# Altium schematic sheet A2D.schdoc
size 465 x 382 mm
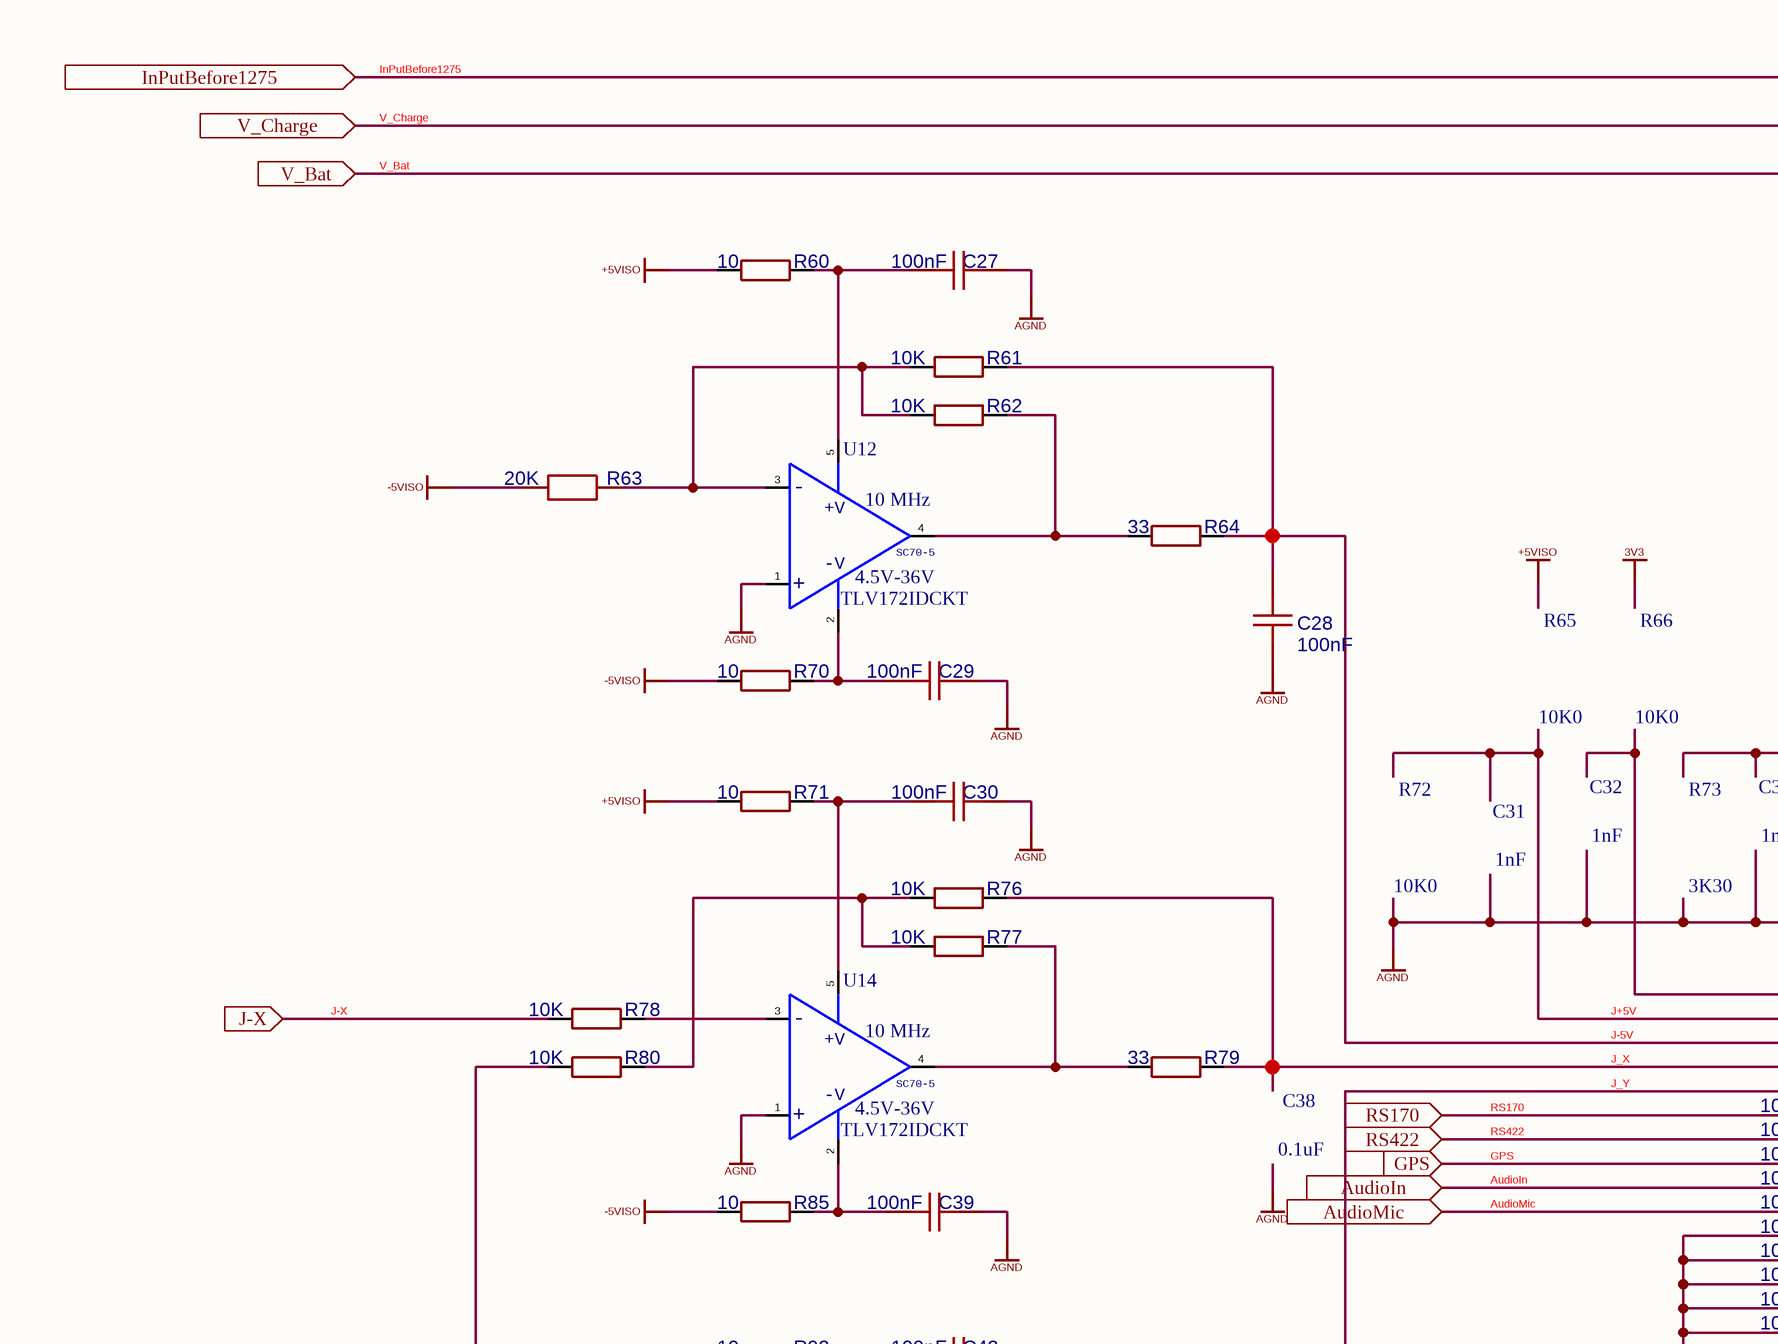
[diagram p0: A2D.schdoc, top left]
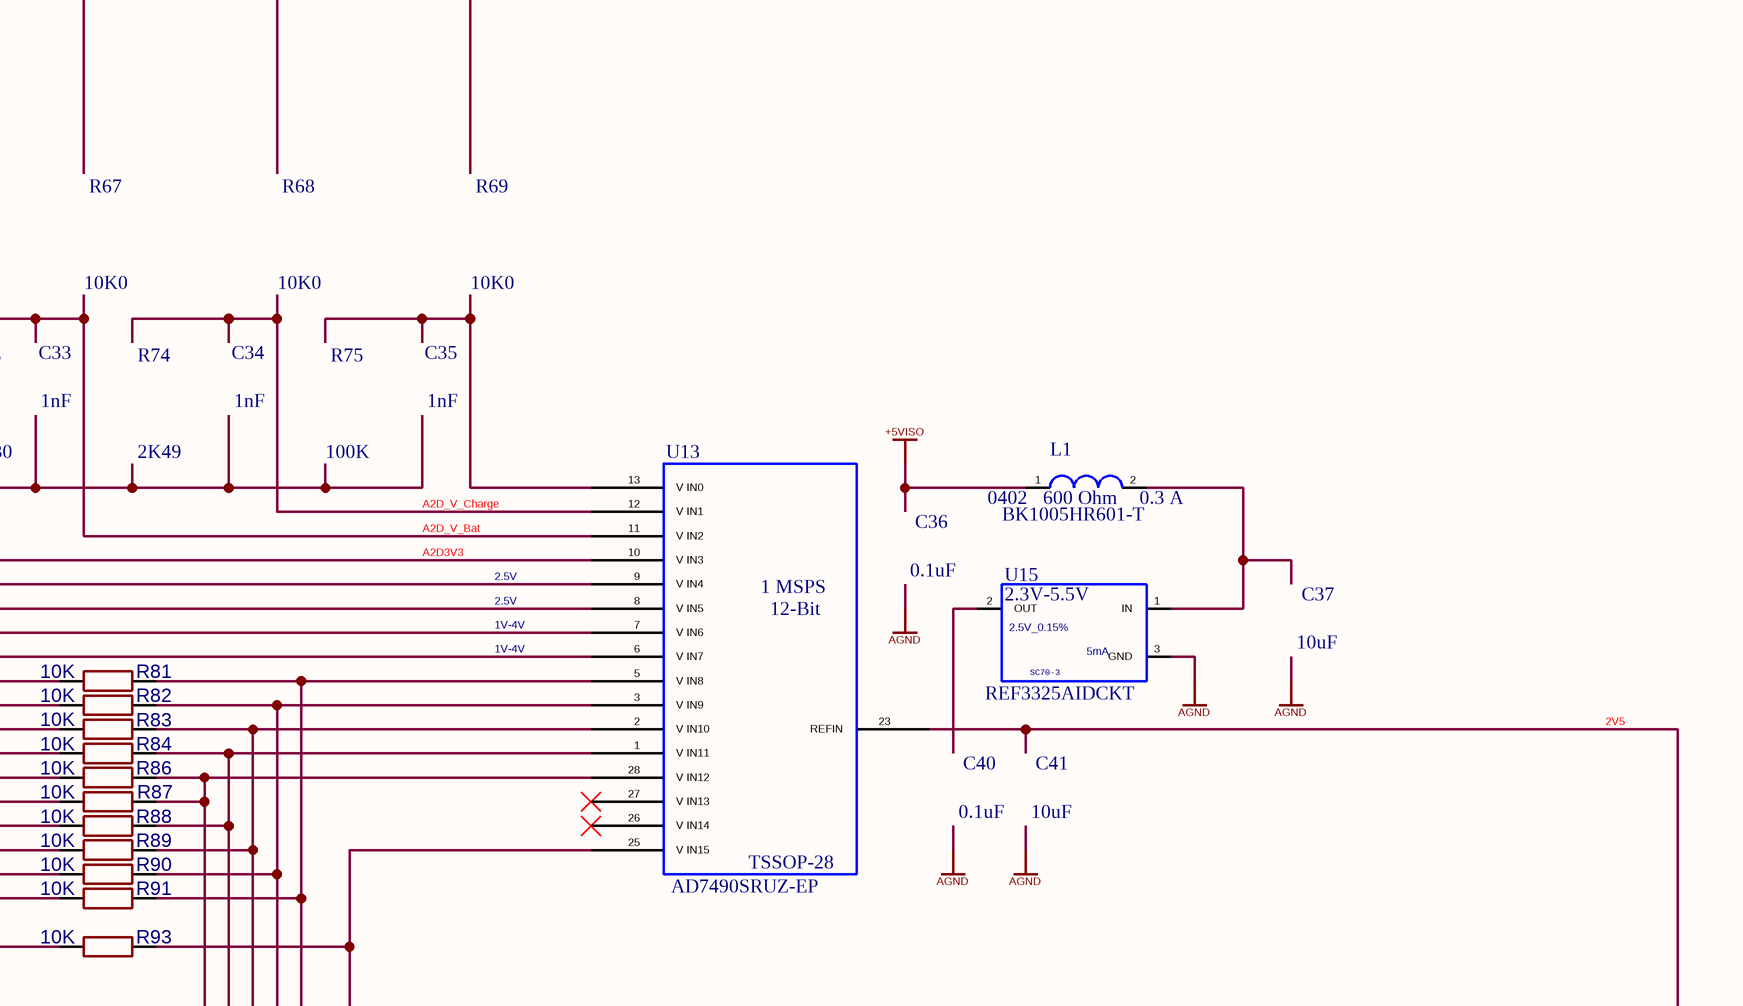
[diagram p1: A2D.schdoc, top right]
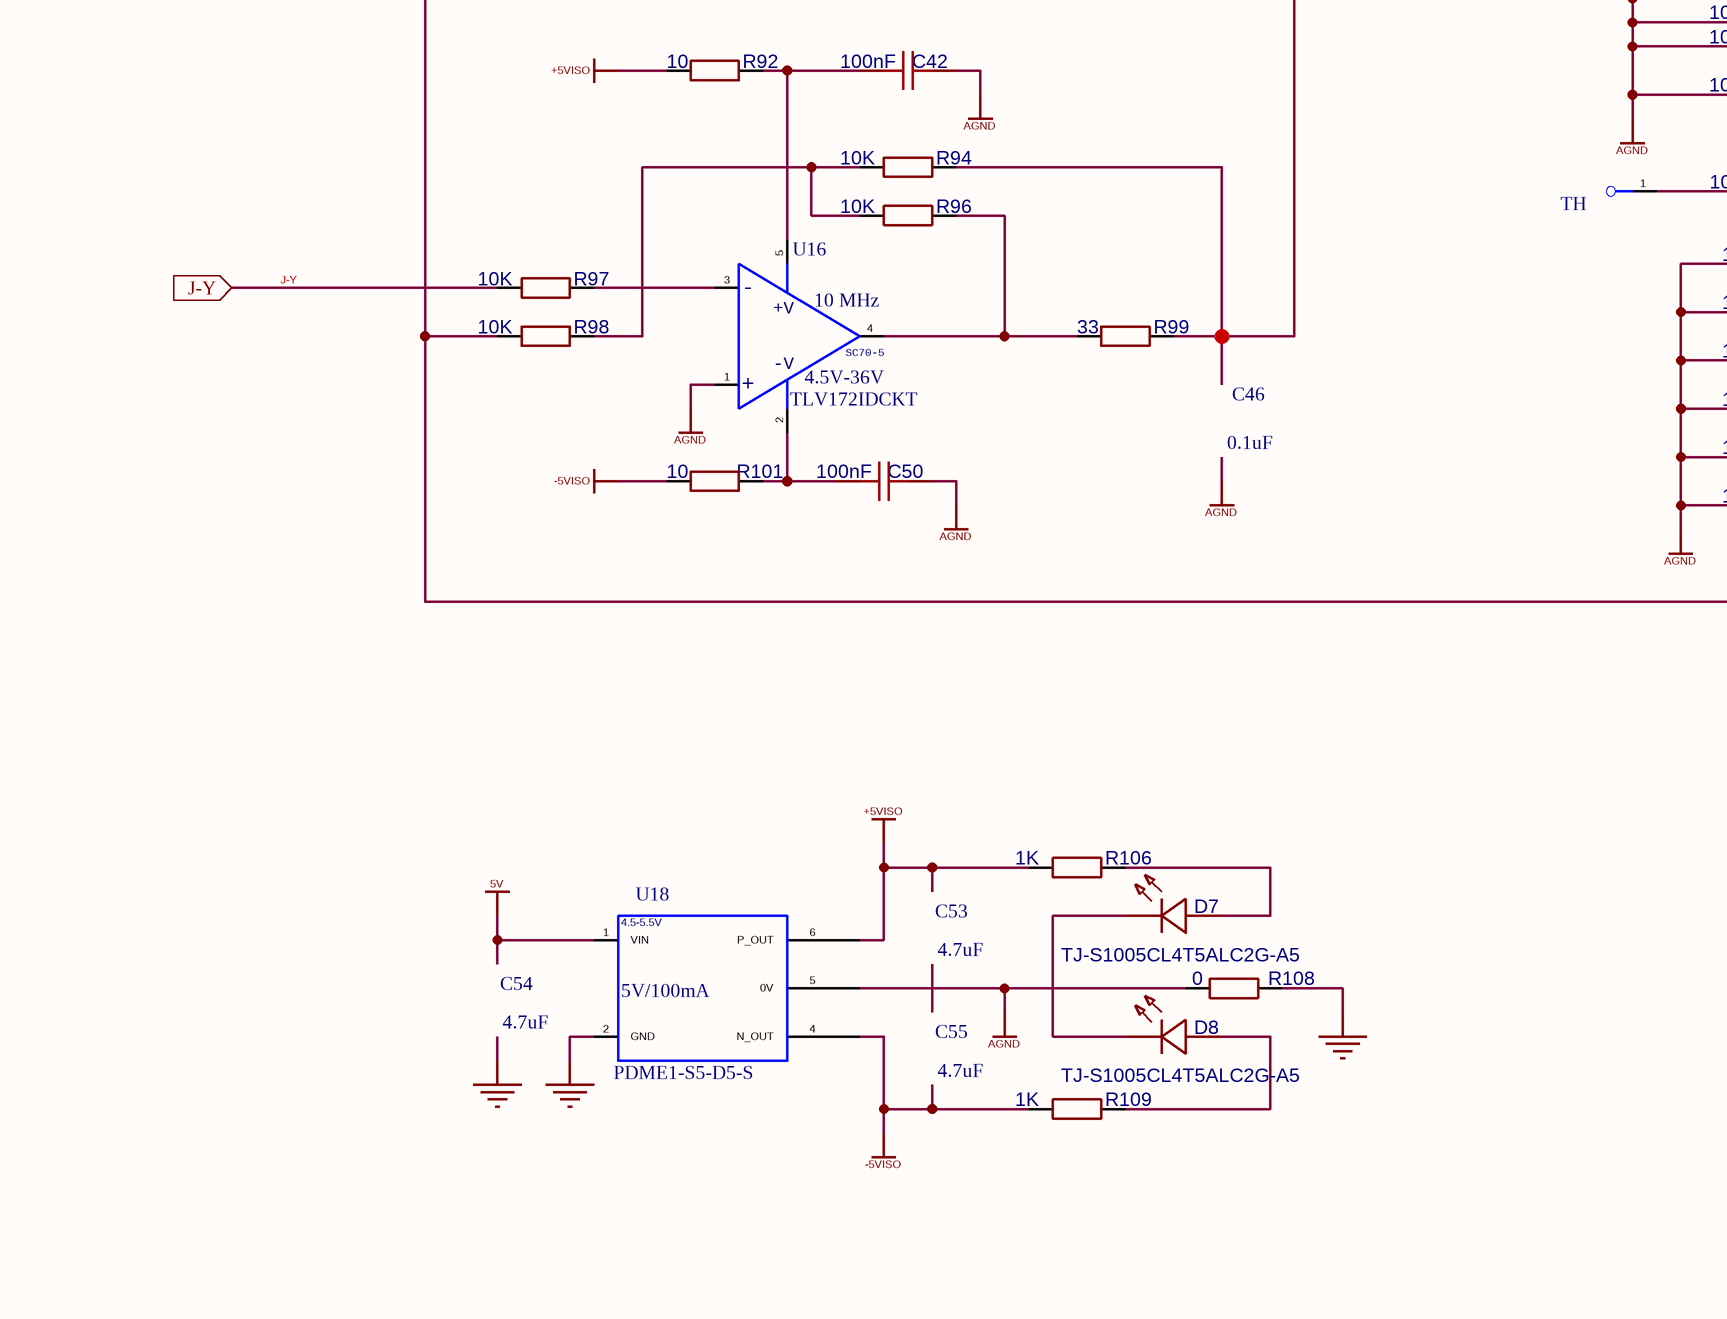
[diagram p2: A2D.schdoc, bottom left]
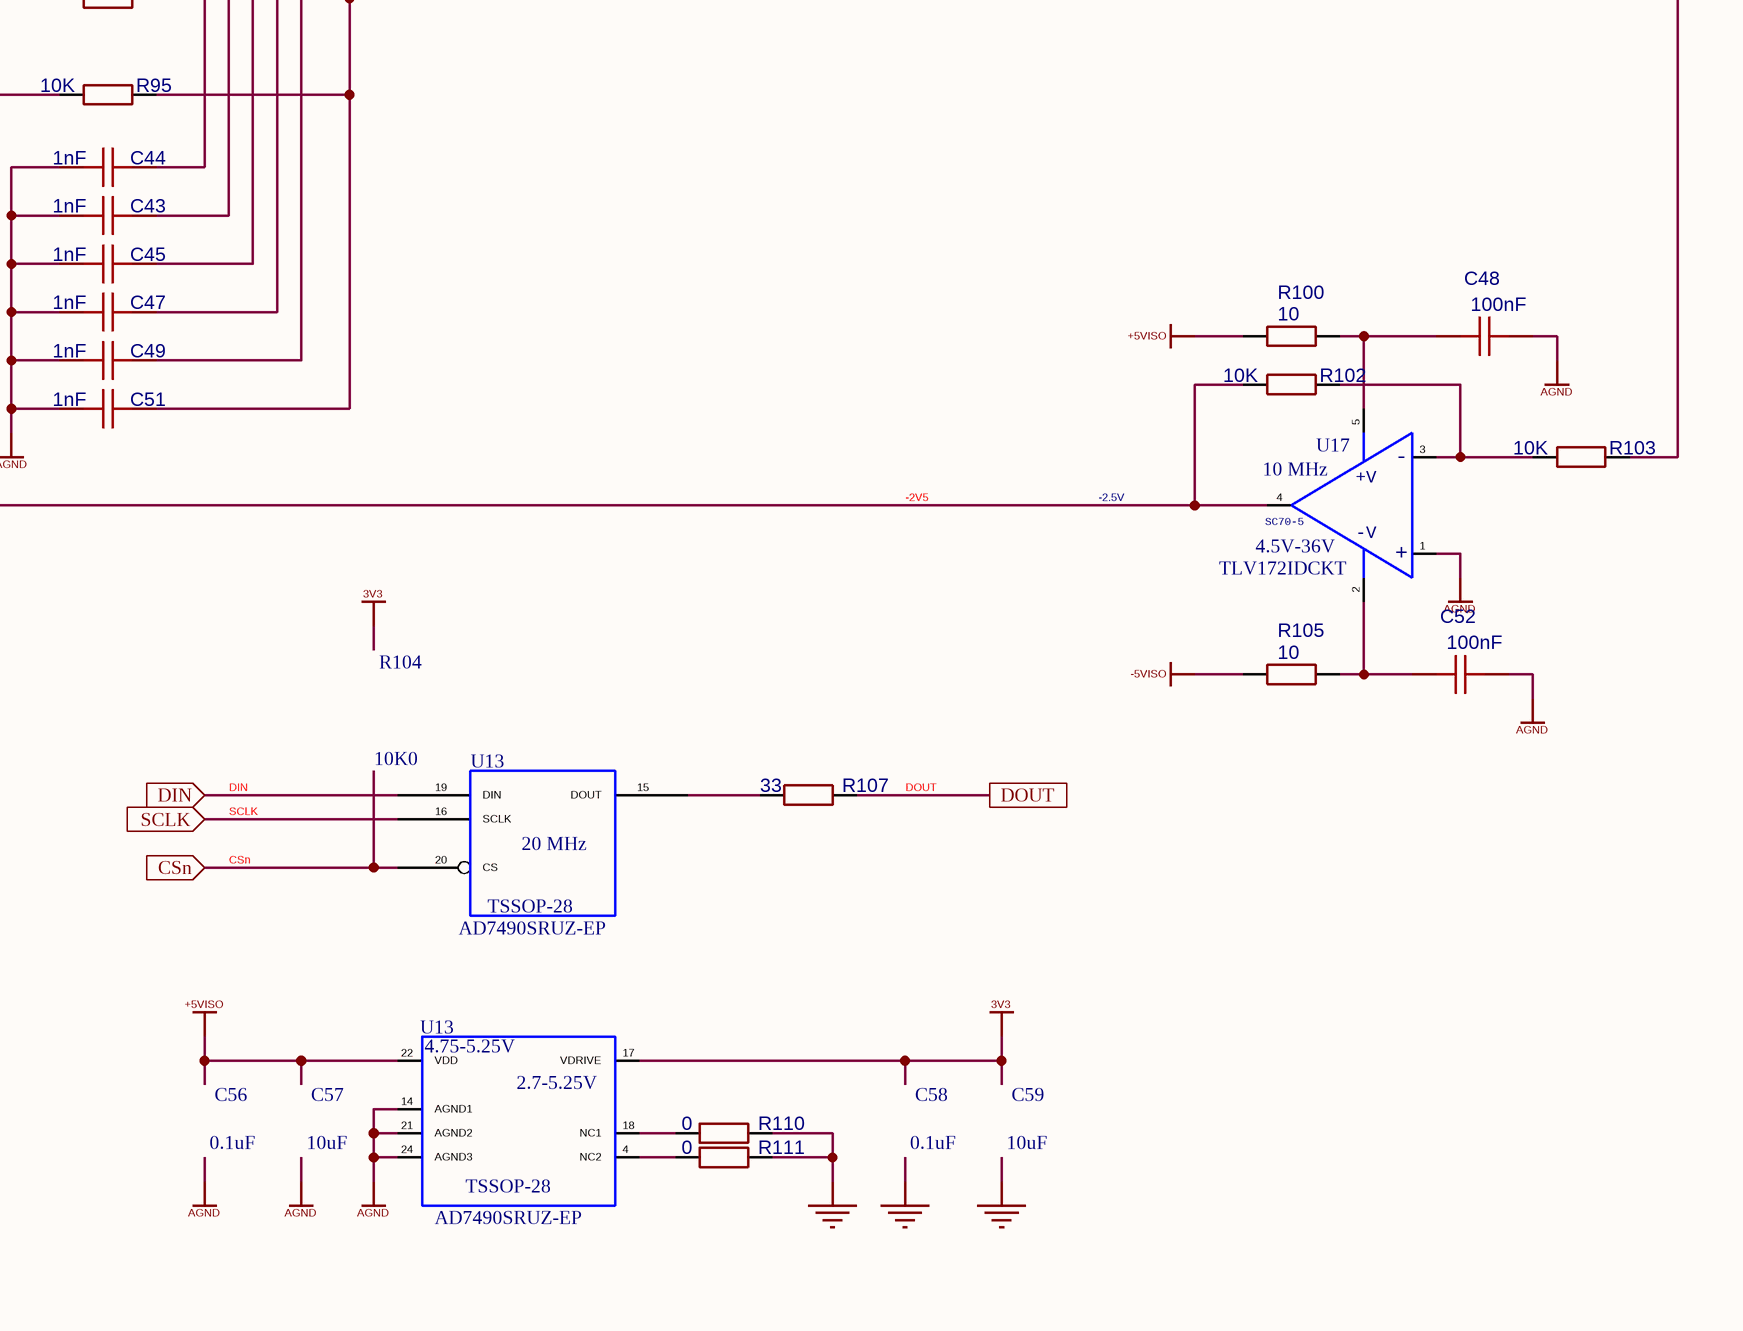
[diagram p3: A2D.schdoc, bottom right]

## Parts
(Parts that share a designator on the sheet are numbered #1, #2 ... from top to bottom, then left to right.)
C27  100nF  [C0402]
C28  100nF  [C0402]
C29  100nF  [C0402]
C30  100nF  [C0402]
C31  1nF  [0402]
C32  1nF  [0402]
C33  1nF  [0402]
C34  1nF  [0402]
C35  1nF  [0402]
C36  0.1uF  [0402]
C37  10uF  [0402]
C38  0.1uF  [0402]
C39  100nF  [C0402]
C40  0.1uF  [0402]
C41  10uF  [0402]
C42  100nF  [C0402]
C43  1nF  [C0402]
C44  1nF  [C0402]
C45  1nF  [C0402]
C46  0.1uF  [0402]
C47  1nF  [C0402]
C48  100nF  [C0402]
C49  1nF  [C0402]
C50  100nF  [C0402]
C51  1nF  [C0402]
C52  100nF  [C0402]
C53  4.7uF  [0603]
C54  4.7uF  [0603]
C55  4.7uF  [0603]
C56  0.1uF  [0402]
C57  10uF  [0402]
C58  0.1uF  [0402]
C59  10uF  [0402]
D7  TJ-S1005CL4T5ALC2G-A5  [LED0402-RD]
D8  TJ-S1005CL4T5ALC2G-A5  [LED0402-RD]
ICT1  TH  [CASCODIUM_TP_ICT]
L1  BK1005HR601-T  [L0402]
R60  10  [R0402]
R61  10K  [R0402]
R62  10K  [R0402]
R63  20K  [R0402]
R64  33  [R0402]
R65  10K0  [0402]
R66  10K0  [0402]
R67  10K0  [0402]
R68  10K0  [0402]
R69  10K0  [0402]
R70  10  [R0402]
R71  10  [R0402]
R72  10K0  [0402]
R73  3K30  [0402]
R74  2K49  [0402]
R75  100K  [0402]
R76  10K  [R0402]
R77  10K  [R0402]
R78  10K  [R0402]
R79  33  [R0402]
R80  10K  [R0402]
R81  10K  [R0402]
R82  10K  [R0402]
R83  10K  [R0402]
R84  10K  [R0402]
R85  10  [R0402]
R86  10K  [R0402]
R87  10K  [R0402]
R88  10K  [R0402]
R89  10K  [R0402]
R90  10K  [R0402]
R91  10K  [R0402]
R92  10  [R0402]
R93  10K  [R0402]
R94  10K  [R0402]
R95  10K  [R0402]
R96  10K  [R0402]
R97  10K  [R0402]
R98  10K  [R0402]
R99  33  [R0402]
R100  10  [R0402]
R101  10  [R0402]
R102  10K  [R0402]
R103  10K  [R0402]
R104  10K0  [0402]
R105  10  [R0402]
R106  1K  [R0402]
R107  33  [R0402]
R108  0  [R0402]
R109  1K  [R0402]
R110  0  [R0402]
R111  0  [R0402]
U12  TLV172IDCKT  [SC70-5]
U13#1  AD7490SRUZ-EP  [TSSOP-28_AD7490SRUZ]
U13#2  AD7490SRUZ-EP  [TSSOP-28_AD7490SRUZ]
U13#3  AD7490SRUZ-EP  [TSSOP-28_AD7490SRUZ]
U14  TLV172IDCKT  [SC70-5]
U15  REF3325AIDCKT  [SC70-3_REF3320AIDCKR]
U16  TLV172IDCKT  [SC70-5]
U17  TLV172IDCKT  [SC70-5]
U18  PDME1-S5-D5-S  [PDME1-S5-D5-S]

## Ports
AudioIn (in), AudioMic (in), CSn (in), DIN (in), DOUT (in), GPS (in), InPutBefore1275 (in), J-X (in), J-Y (in), RS170 (in), RS422 (in), SCLK (in), V_Bat (in), V_Charge (in)

## Nets
3V3: U13#3.17(VDRIVE)
5V: U18.1(VIN)
+5VISO: L1.1 R60.1 R71.1 R92.1 R100.1 R106.1 U13#3.22(VDD) U18.6(P_OUT)
-5VISO: R63.1 R70.1 R85.1 R101.1 R105.1 R109.1 U18.4(N_OUT)
AGND: C27.1 C28.2 C29.1 C30.1 C39.1 C42.1 C43.1 C44.1 C45.1 C47.1 C48.1 C49.1 C50.1 C51.1 C52.1 R87.1 R88.1 R89.1 R90.1 R91.1 R93.1 R108.1 U12.1(+In) U13#3.14(AGND1) U13#3.21(AGND2) U13#3.24(AGND3) U14.1(+In) U15.3(GND) U16.1(+In) U17.1(+In) U18.5(0V)
GND: R108.2 R110.2 R111.2 U18.2(GND)
2V5: R103.2 U13#1.23(REFIN) U15.2(OUT)
-2V5: R80.1 R98.1 R102.1 U17.4(OutPut)
A2D3V3: U13#1.10(V_IN3)
A2D_V_Bat: U13#1.11(V_IN2)
A2D_V_Charge: U13#1.12(V_IN1)
AudioIn: R84.1 ; port AudioIn
AudioMic: R86.1 ; port AudioMic
CSn: U13#2.20(CS) ; port CSn
DIN: U13#2.19(DIN) ; port DIN
DOUT: R107.2 ; port DOUT
GPS: R83.1 ; port GPS
InPutBefore1275: port InPutBefore1275
J+5V: U13#1.9(V_IN4)
J-5V: C28.1 R61.2 R64.2 U13#1.8(V_IN5)
J-X: R78.1 ; port J-X
J-Y: R97.1 ; port J-Y
J_X: R76.2 R79.2 U13#1.7(V_IN6)
J_Y: R81.1 R82.1 R94.2 R99.2 U13#1.6(V_IN7) ; port RS170, port RS422  [also labelled RS170, RS422]
SCLK: U13#2.16(SCLK) ; port SCLK
V_Bat: port V_Bat
V_Charge: port V_Charge
NetC27_2: C27.2 R60.2 U12.5(+V)
NetC29_2: C29.2 R70.2 U12.2(-V)
NetC30_2: C30.2 R71.2 U14.5(+V)
NetC39_2: C39.2 R85.2 U14.2(-V)
NetC42_2: C42.2 R92.2 U16.5(+V)
NetC43_2: C43.2 R84.2 R88.2 U13#1.1(V_IN11)
NetC44_2: C44.2 R86.2 R87.2 U13#1.28(V_IN12)
NetC45_2: C45.2 R83.2 R89.2 U13#1.2(V_IN10)
NetC47_2: C47.2 R82.2 R90.2 U13#1.3(V_IN9)
NetC48_2: C48.2 R100.2 U17.5(+V)
NetC49_2: C49.2 R81.2 R91.2 U13#1.5(V_IN8)
NetC50_2: C50.2 R101.2 U16.2(-V)
NetC51_2: C51.2 R93.2 R95.2 U13#1.25(V_IN15)
NetC52_2: C52.2 R105.2 U17.2(-V)
NetD7_1: D7.1(K) D8.1(K)
NetD7_2: D7.2(A) R106.2
NetD8_2: D8.2(A) R109.2
NetICT1_1: ICT1.1 R95.1
NetL1_2: L1.2 U15.1(IN)
NetR61_1: R61.1 R62.1 R63.2 U12.3(-In)
NetR62_2: R62.2 R64.1 U12.4(OutPut)
NetR76_1: R76.1 R77.1 R80.2
NetR77_2: R77.2 R79.1 U14.4(OutPut)
NetR78_2: R78.2 U14.3(-In)
NetR94_1: R94.1 R96.1 R98.2
NetR96_2: R96.2 R99.1 U16.4(OutPut)
NetR97_2: R97.2 U16.3(-In)
NetR102_2: R102.2 R103.1 U17.3(-In)
NetR107_1: R107.1 U13#2.15(DOUT)
NetR110_1: R110.1 U13#3.18(NC1)
NetR111_1: R111.1 U13#3.4(NC2)

Not connected (* = marked no-connect by the designer): U13#1 13(V_IN0) 26(V_IN14)* 27(V_IN13)*

## Notes on the sheet
- 1V-4V
- 2.5V
- -2.5V
- (in symbol REF3325AIDCKT) SC70-3
- (in symbol TLV172IDCKT) -; SC70-5; +

## Library data of the parts
C27-C30 C39 C42 C48 C50 C52 = 100nF: BOM_Manufacturer: TDK; BOM_Manufacturer Part: C1005X7R1C104KT000F; nameAlias: Capacitance; Contributor: LCSC; BOM_Supplier: LCSC; BOM_Supplier Part: C338032; spicePre: C; spiceSymbolName: C1005X7R1C104KT000F
C31-C35 = 1nF: Part Number: C0402C102J5JAC7867; VOLTAGE: 50V; TYPE: U2J; PCBFootPrint: 0402   U2J; OVPN: OVCC00016; NO_XNET_CONNECTION: True; MFG: KEMET; ALT_SYMBOLS: 0402_RND; PCB Footprint: 0402
C36 C38 C40 C46 C56 C58 = 0.1uF: Part Number: CC0402KRX7R7BB104; NO_XNET_CONNECTION: True; VOLTAGE: 16V; TYPE: X7R; PCBFootPrint: 0402   X7R; OVPN: OVCC00002; MFG: Yageo; ALT_SYMBOLS_HARD: 0402_RND; ALT_SYMBOLS: 0402_RND; PCB Footprint: 0402
C37 C41 C57 C59 = 10uF: Part Number: GRM155C80J106ME11J; VOLTAGE: 6.3V; TYPE: X6S; PCBFootPrint: 0402   X6S; OVPN: OVCC00087; NO_XNET_CONNECTION: True; MFG: Murata Electronics; PCB Footprint: 0402
C43-C45 C47 C49 C51 = 1nF: BOM_Manufacturer: Huaxin S&T; BOM_Manufacturer Part: 0402B102K500CT; nameAlias: Capacitance; Contributor: LCSC; BOM_Supplier: LCSC; BOM_Supplier Part: C301925; spicePre: C; spiceSymbolName: 0402B102K500CT
C53-C55 = 4.7uF: Part Number: C1608X6S1C475M080AC; VOLTAGE: 16V; PCBFootPrint: 0603   X6S; OVPN: OVCC00034; NO_XNET_CONNECTION: True; MFG: TDK Corporation; PCB Footprint: 0603
D7 D8 = TJ-S1005CL4T5ALC2G-A5: BOM_Manufacturer: TOGIALED; Contributor: LCSC; BOM_Supplier: LCSC; BOM_Supplier Part: C917188; BOM_Manufacturer Part: TJ-S1005CL4T5ALC2G-A5; BOM_JLCPCB Part Class: Extended Part; spicePre: L; spiceSymbolName: TJ-S1005CL4T5ALC2G-A5
ICT1 = TH: PCB Footprint: ICT; ASSY: N/A
L1 = BK1005HR601-T: Impedance: 600 Ohm; PcbFootPrint: 0402; OVPN: OVLF00014; NO_XNET_CONNECTION: True; MFG: Taiyo Yuden; Current: 0.3 A; Part Number: BK1005HR601-T; PCB Footprint: L0402
R60 R70 R71 R85 R92 R100 R101 R105 = 10: BOM_Manufacturer: RALEC; BOM_Manufacturer Part: RTT0210R0FTH; nameAlias: Resistance (Ohms); BOM_Supplier: LCSC; BOM_Supplier Part: C102766; BOM_JLCPCB Part Class: Extended Part; spicePre: R; spiceSymbolName: RTT0210R0FTH
R61 R62 R76-R78 R80-R84 R86-R91 R93-R98 R102 R103 = 10K: BOM_Manufacturer: UniOhm; BOM_Manufacturer Part: 0402WGF1002TCE; nameAlias: Resistance (Ohms); BOM_Supplier: LCSC; BOM_Supplier Part: C25744; BOM_JLCPCB Part Class: Basic Part; spicePre: R; spiceSymbolName: 0402WGF1002TCE
R63 = 20K: BOM_Manufacturer: Viking Tech; BOM_Manufacturer Part: CR-02FL6---20K; nameAlias: Resistance (Ohms); Contributor: LCSC; BOM_Supplier: LCSC; BOM_Supplier Part: C409679; spicePre: R; spiceSymbolName: CR-02FL6---20K
R64 R79 R99 R107 = 33: BOM_Manufacturer: YAGEO; BOM_Manufacturer Part: RC0402FR-0733RL; nameAlias: Resistance (Ohms); Contributor: LCSC; BOM_Supplier: LCSC; BOM_Supplier Part: C138002; spicePre: R; spiceSymbolName: RC0402FR-0733RL
R65-R69 R72 R104 = 10K0: Part Number: RC0402FR-0710KL; NO_XNET_CONNECTION: True; Tolerance: 1%; Power: 1/16W; OVPN: OVRS00009; MFG: Yageo; MOUNTING: SMT
R73 = 3K30: Part Number: RT0402FRE073K3L; Tolerance: 1%; Power: 1/16W; OVPN: OVRS00028; NO_XNET_CONNECTION: True; MFG: Yageo; MOUNTING: SMT
R74 = 2K49: Part Number: RC0402FR-072K49L; NO_XNET_CONNECTION: True; Tolerance: 1%; Power: 1/16W; OVPN: OVRS00004; MFG: Yageo; MOUNTING: SMT
R75 = 100K: Part Number: RC0402FR-07100KL; NO_XNET_CONNECTION: True; Tolerance: 1%; Power: 1/16W; OVPN: OVRS00003; MFG: Yageo; ASSY: NC; MOUNTING: SMT
R106 R109 = 1K: BOM_Manufacturer: YAGEO; BOM_Manufacturer Part: RC0402FR-071KL; nameAlias: Resistance (Ohms); BOM_Paste Type: Extended Part; BOM_Supplier: LCSC; BOM_Supplier Part: C106235; BOM_JLCPCB Part Class: Extended Part; spicePre: R; spiceSymbolName: RC0402FR-071KL
R108 R110 R111 = 0: BOM_Manufacturer: YAGEO; BOM_Manufacturer Part: RC0402JR-070RL; nameAlias: Resistance (Ohms); BOM_Supplier: LCSC; BOM_Supplier Part: C60485; BOM_JLCPCB Part Class: Extended Part; spicePre: R; spiceSymbolName: RC0402JR-070RL
U12 = TLV172IDCKT: Bandwidth: 10 MHz; MFG: Texas Instruments; OVPN: OVIC00220; VOLTAGE: 4.5V-36V; PCB Footprint: SC70-5_TLV172IDCKT; Package Display: No; PART NUMBER: TLV172IDCKT
U13#1-U13#3 = AD7490SRUZ-EP: PART NUMBER: AD7490SRUZ-EP-RL7; fSCLK: 20 MHz; Voltage: 2.7-5.25V; VDD: 4.75-5.25V; Throughput rates: 1 MSPS; Resolution: 12-Bit; PcbFootprint: TSSOP-28; OVPN: OVIC00219; MFG: Analog Devices Inc.; PCB Footprint: TSSOP-28_AD7490SRUZ
U14 U16 U17 = TLV172IDCKT: Bandwidth: 10 MHz; MFG: Texas Instruments; OVPN: OVIC00220; VOLTAGE: 4.5V-36V; PCB Footprint: SC70-5_TLV172IDCKT; PART NUMBER: TLV172IDCKT
U15 = REF3325AIDCKT: Current: 5mA; Definition: 2.5V_0.15%; MFG: Texas Instruments; OVPN: OVIC00251; Voltage: 2.3V-5.5V; PART NUMBER: REF3325AIDCKT; PCB Footprint: SC70-3_REF3320AIDCKR
U18 = PDME1-S5-D5-S: Power: 4.5-5.5V; MFG: CUI Inc.; Voltage: 5V/100mA; OVPN: OVIC00225; PART NUMBER: PDME1-S5-D5-S; PCB Footprint: PDME1-S5-D5-S